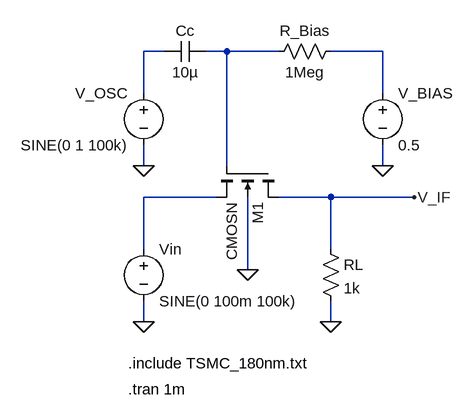
[diagram p0: schematic Switch.asc]
Switch.asc, the LTspice schematic file:
Version 4
SHEET 1 880 680
WIRE 80 -48 48 -48
WIRE 176 -48 144 -48
WIRE 256 -48 176 -48
WIRE 416 -48 336 -48
WIRE 48 16 48 -48
WIRE 416 16 416 -48
WIRE 48 128 48 96
WIRE 176 128 176 -48
WIRE 416 128 416 96
WIRE 160 176 48 176
WIRE 336 176 256 176
WIRE 464 176 336 176
WIRE 48 256 48 176
WIRE 336 256 336 176
WIRE 208 288 208 176
WIRE 48 368 48 336
WIRE 336 368 336 336
FLAG 416 128 0
FLAG 208 288 0
FLAG 336 368 0
FLAG 48 368 0
FLAG 48 128 0
FLAG 464 176 V_IF
SYMBOL nmos4 256 128 R90
SYMATTR InstName M1
SYMATTR Value CMOSN
SYMATTR Value2 l=0.18u w=1.8u ad=0.81p as=0.81p pd=4.5u ps=4.5u
SYMBOL voltage 48 240 R0
WINDOW 123 0 0 Left 0
WINDOW 39 0 0 Left 0
SYMATTR InstName Vin
SYMATTR Value SINE(0 100m 100k)
SYMBOL voltage 48 0 M0
WINDOW 123 0 0 Left 0
WINDOW 39 0 0 Left 0
SYMATTR InstName V_OSC
SYMATTR Value SINE(0 1 100k)
SYMBOL voltage 416 0 R0
WINDOW 123 0 0 Left 0
WINDOW 39 0 0 Left 0
SYMATTR InstName V_BIAS
SYMATTR Value 0.5
SYMBOL res 352 -64 R90
WINDOW 0 0 56 VBottom 2
WINDOW 3 32 56 VTop 2
SYMATTR InstName R_Bias
SYMATTR Value 1Meg
SYMBOL res 320 240 R0
SYMATTR InstName RL
SYMATTR Value 1k
SYMBOL cap 144 -64 R90
WINDOW 0 0 32 VBottom 2
WINDOW 3 32 32 VTop 2
SYMATTR InstName Cc
SYMATTR Value 10µ
TEXT 24 432 Left 2 !.include TSMC_180nm.txt
TEXT 24 472 Left 2 !.tran 1m

The netlist it stands for:
* Switch.asc
M1 V_IF N002 N004 0 CMOSN l=0.18u w=1.8u ad=0.81p as=0.81p pd=4.5u ps=4.5u
Vin N004 0 SINE(0 100m 100k)
V_OSC N001 0 SINE(0 1 100k)
V_BIAS N003 0 0.5
R_Bias N003 N002 1Meg
RL V_IF 0 1k
Cc N002 N001 10µ
.model NMOS NMOS
.model PMOS PMOS
.lib standard.mos
.include TSMC_180nm.txt
.tran 1m
.backanno
.end